# EasyEDA Pro project G-CU ver 2.3.C.eprj, board PCB1
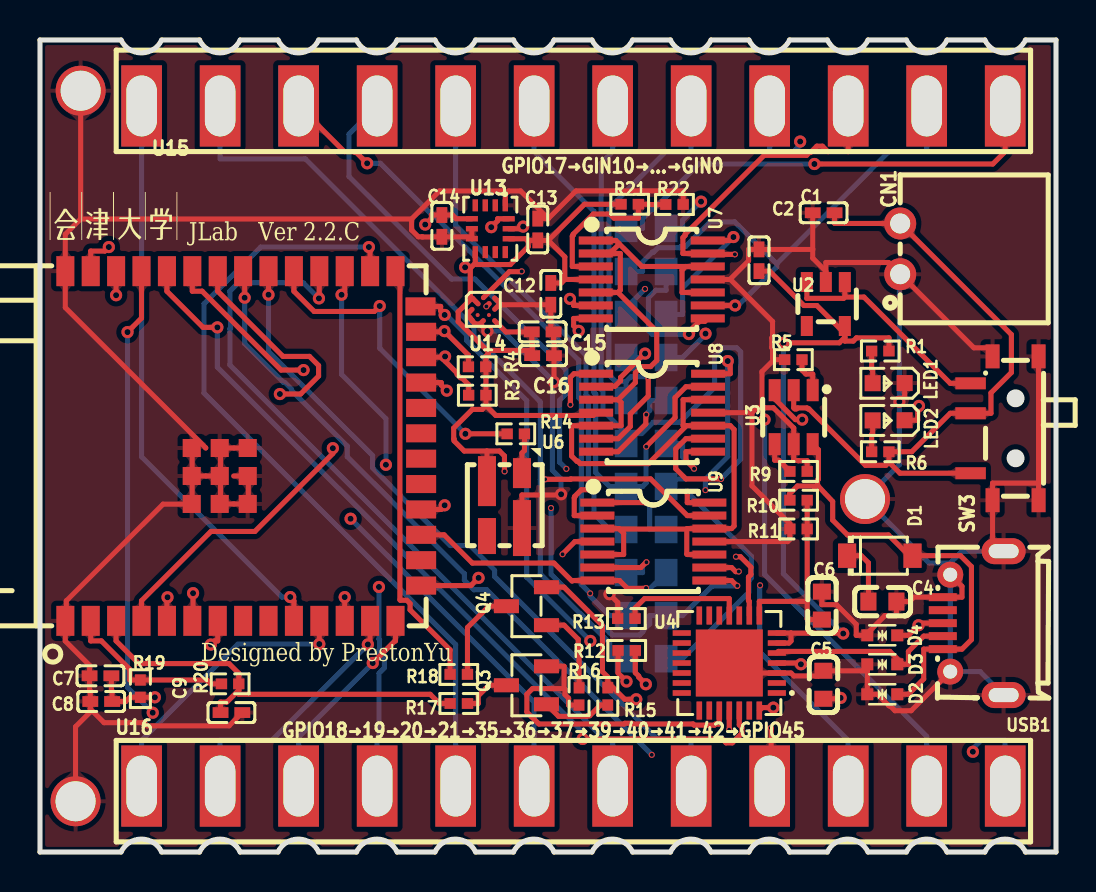
[diagram p2: board, top side]
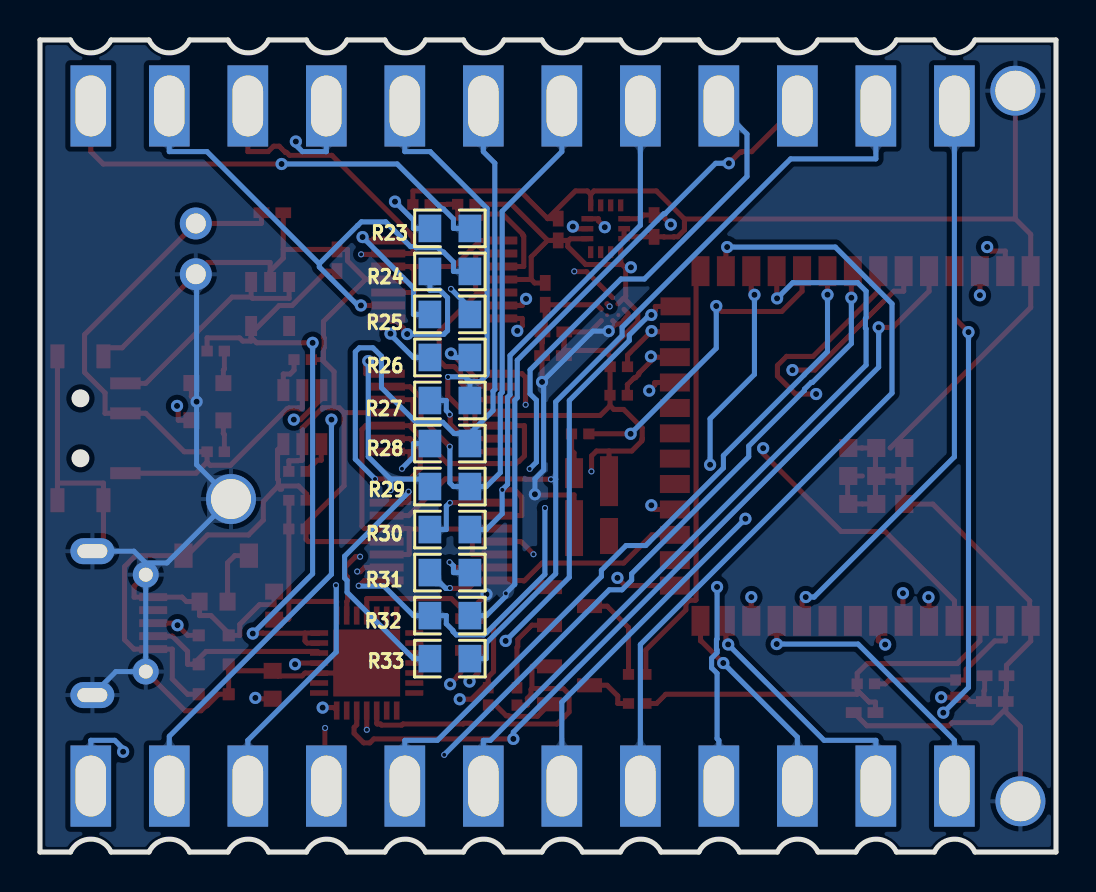
[diagram p3: board, bottom side, seen from below]

Outline 50.8 x 40.64 mm; copper layers: Top Layer, 信号层1, 信号层2, Bottom Layer. Coordinates in mm from the lower left corner of the outline.
Outline path: 0,40.64 0,0 4.05,0 arc(5.07,0.65) 6.08,0 7.98,0 arc(8.99,0.65) 10.01,0 11.9,0 arc(12.92,0.65) 13.93,0 15.83,0 arc(16.84,0.65) 17.86,0 19.75,0 arc(20.77,0.65) 21.78,0 23.67,0 arc(24.69,0.65) 25.71,0 27.6,0 arc(28.61,0.65) 29.63,0 31.52,0 arc(32.54,0.65) 33.55,0 35.45,0 arc(36.46,0.65) 37.48,0 39.37,0 arc(40.39,0.65) 41.4,0 43.32,0 arc(44.34,0.65) 45.35,0 47.24,0 arc(48.26,0.65) 49.28,0 50.8,0 50.8,40.64 49.28,40.64 arc(48.26,39.99) 47.25,40.64 45.35,40.64 arc(44.34,39.99) 43.32,40.64 41.4,40.64 arc(40.39,39.99) 39.37,40.64 37.48,40.64 arc(36.46,39.99) 35.45,40.64 33.55,40.64 arc(32.54,39.99) 31.52,40.64 29.63,40.64 arc(28.61,39.99) 27.6,40.64 25.71,40.64 arc(24.69,39.99) 23.67,40.64 21.78,40.64 arc(20.77,39.99) 19.75,40.64 17.86,40.64 arc(16.84,39.99) 15.83,40.64 13.93,40.64 arc(12.92,39.99) 11.9,40.64 10.01,40.64 arc(8.99,39.99) 7.98,40.64 6.08,40.64 arc(5.07,39.99) 4.05,40.64 0,40.64
Stack: Top Layer 0.035mm 外层铜厚1oz / Dielectric1 0.2104mm 7628 RC49% 8.6mil / 信号层1 0.035mm / Dielectric2 1.065mm 1.1mm H/HOZ Copper / 信号层2 0.035mm / Dielectric3 0.2104mm 7628 RC49% 8.6mil / Bottom Layer 0.035mm 外层铜厚1oz

## Design rules (mm)
template: JLCPCB Capability(Multiple Layers Board)
spacing copperThickness1oz (default): track to track 0.102, other pairs 0.152 to 0.3
spacing copperThickness2oz: track to track 0.203, other pairs 0.152 to 0.3
spacing copperThicknessInner0.5oz: track to track 0.089, other pairs 0.152 to 0.3
track width copperThickness1oz (default): min 0.102, default 0.254, max 2.54
track width copperThickness2oz: min 0.203, default 0.254, max 2.54
track width copperThickness0.5oz: min 0.089, default 0.254, max 2.54
differential pair differentialPair (default): width min 0.127, default 0.254, max 2.54; gap min 0.152, default 0.152
via viaSize (default): diameter min 0.3, default 0.61, max 10; hole min 0.2, default 0.305, max 6.3

## Placement (name value [footprint] x y rotation side)
C1  1uF  [c0402]  39.18 31.99 0 top
C2  1uF  [C0402]  35.95 29.61 270 top
C4  10uF  [C0603]  42.12 12.53 180 top
C5  10uF  [C0603]  39.17 8.37 270 top
C6  1uF  [C0603]  39.1 12.33 270 top
C7  10uF  [C0402]  3.02 8.82 0 top
C8  100pF  [C0402]  3.06 7.53 0 top
C9  1uF  [C0402]  9.57 6.98 180 top
C12  100pF  [C0402]  25.54 27.93 270 top
C13  100nF  [C0402]  24.89 31.15 270 top
C14  100nF  [C0402]  20.09 31.33 90 top
C15  100nF  [C0402]  25.13 26.03 180 top
C16  100nF  [C0402]  25.15 24.84 180 top
CN1  XH-2AW  [CONN-TH_XH-2AW_C2908611]  43.01 30.19 90 top
D1  1N5819HW-7-F  [SOD-123_L2.7-W1.6-LS3.7-RD]  41.99 14.83 0 top
D2  LESD5D5.0CT1G  [SOD-523_L1.2-W0.8-LS1.6-BI]  42.12 7.9 0 top
D3  LESD5D5.0CT1G  [SOD-523_L1.2-W0.8-LS1.6-BI]  42.12 9.39 0 top
D4  LESD5D5.0CT1G  [SOD-523_L1.2-W0.8-LS1.6-BI]  42.12 10.85 0 top
LED1  NCD0603R1  [LED0603-RD_RED]  42.43 23.47 180 top
LED2  NCD0603G1  [LED0603-RD]  42.43 21.6 180 top
NOREF  -  [Pad_e86]  2.03 38.1 0 top
NOREF#2  -  [Pad_e97]  41.25 17.66 0 top
NOREF#3  -  [Pad_e33]  1.78 2.54 0 top
Q3  L8050QLT1G  [SOT-23-3_L2.9-W1.3-P1.90-LS2.4-BR]  24.32 8.34 0 top
Q4  L8050QLT1G  [SOT-23-3_L2.9-W1.3-P1.90-LS2.4-BR]  24.32 12.3 0 top
R1  5.1kΩ  [R0402]  42.02 25.07 180 top
R3  4.7kΩ  [R0402]  21.87 22.86 0 top
R4  4.7kΩ  [R0402]  21.86 24.28 0 top
R5  10kΩ  [R0402]  37.67 24.64 0 top
R6  5.1kΩ  [R0402]  42.02 20.03 0 top
R9  680Ω  [R0402]  37.93 19.05 180 top
R10  22.1kΩ  [R0402]  37.93 17.61 180 top
R11  47.5kΩ  [R0402]  37.93 16.17 0 top
R12  1kΩ  [R0402]  29.33 10.09 180 top
R13  10kΩ  [R0402]  29.32 11.68 0 top
R14  0Ω  [R0402]  23.79 20.93 180 top
R15  10kΩ  [R0402]  28.39 7.79 270 top
R16  10kΩ  [R0402]  26.95 7.78 90 top
R17  0Ω  [R0402]  20.94 7.43 180 top
R18  0Ω  [R0402]  20.94 8.89 180 top
R19  0Ω  [R0402]  5.02 8.18 90 top
R20  10kΩ  [R0402]  9.51 8.42 180 top
R21  1.8kΩ  [R0402]  29.49 32.42 180 top
R22  200Ω  [R0402]  31.72 32.41 180 top
R23  5kΩ  [R0805]  30.31 31.21 0 bottom
R24  5kΩ  [R0805]  30.31 29.06 0 bottom
R25  5kΩ  [R0805]  30.31 26.9 0 bottom
R26  5kΩ  [R0805]  30.31 24.75 0 bottom
R27  5kΩ  [R0805]  30.31 22.6 0 bottom
R28  5kΩ  [R0805]  30.31 20.44 0 bottom
R29  5kΩ  [R0805]  30.31 18.29 0 bottom
R30  5kΩ  [R0805]  30.31 16.14 0 bottom
R31  5kΩ  [R0805]  30.31 13.98 0 bottom
R32  5kΩ  [R0805]  30.31 11.83 0 bottom
R33  5kΩ  [R0805]  30.31 9.68 0 bottom
SW3  MSK12C02  [SW-TH_MSK12C02]  48.23 21.21 90 top
U1  ESP32-S3-WROOM-1-N4  [WIRELM-SMD_ESP32-S3-WROOM-1]  10.16 20.32 90 top
U2  TLV75733PDBVR  [SOT-23-5_L2.9-W1.6-P0.95-LS2.8-BL]  39.29 27.43 180 top
U3  BQ21040DBVR  [SOT-23-6_L2.9-W1.6-P0.95-LS2.8-BR]  37.69 21.76 90 top
U4  CP2102N-A02-GQFN28  [QFN-28_L5.0-W5.0-P0.50-TL-EP3.3]  34.47 9.46 180 top
U6  SK6812mini  [LED-SMD_4P-L3.7-W3.5-P1.75-BR-SK6812MINI]  23.22 17.39 90 top
U7  OPA4314AIPWR  [TSSOP-14_L5.0-W4.4-P0.65-LS6.4-BL]  30.59 28.65 270 top
U8  OPA4314AIPWR  [TSSOP-14_L5.0-W4.4-P0.65-LS6.4-BL]  30.61 21.99 270 top
U9  OPA4314AIPWR  [TSSOP-14_L5.0-W4.4-P0.65-LS6.4-BL]  30.67 15.54 270 top
U13  BMI270  [LGA-14_L3.0-W2.5-P0.50-BR]  22.52 31.19 90 top
U14  BMM150  [WLCSP-12_L1.6-W1.6_BMM150]  22.17 27.16 90 top
U15  -  [GCU-CON ver 1.1.C]  49.53 35.05 180 top
U16  -  [GCU-CON ver 1.1.C]  3.81 5.59 0 top
USB1  MicroXNJ  [MICRO-USB-SMD_MICROXNJ]  46.66 11.45 90 top

## Footprints (pads in the part's own frame, mm; a bottom-side part is the same pattern mirrored in y, then rotated)
C0402
  rect 0.79x0.54 smd: 1(-0.545,0) 2(0.545,0)
c0402
  rect 0.79x0.54 smd: 1(-0.545,0) 2(0.545,0)
C0603
  rect 0.8x0.9 smd: 1(-0.7,0) 2(0.7,0)
CONN-TH_XH-2AW_C2908611
  round 1.6 hole 1: 1(-1.27,0) 2(1.27,0)
GCU-CON ver 1.1.C
  rect 2.032x4.064 hole 1.524x3.048: 1(1.27,-2.286) 2(5.196,-2.286) 3(9.121,-2.286) 4(13.046,-2.286) 5(16.972,-2.286) 6(20.898,-2.286) 7(24.823,-2.286) 8(28.748,-2.286) 9(32.673,-2.286) 10(36.599,-2.286) 11(40.525,-2.286) 12(44.45,-2.286)
LED0603-RD
  rect 0.8x0.8 smd: 1(-0.799,-0.004) 2(0.799,0.004)
LED0603-RD_RED
  rect 0.8x0.8 smd: 1(-0.799,-0.004) 2(0.799,0.004)
LED-SMD_4P-L3.7-W3.5-P1.75-BR-SK6812MINI
  rect 1.5x0.9 smd: 1(1.575,-0.875)
  rect 2.5x0.9 smd: 2(1.175,0.875)
  rect 1.8x0.9 smd: 3(-1.575,0.875)
  rect 2.8x0.9 smd: 4(-1.175,-0.875)
LGA-14_L3.0-W2.5-P0.50-BR
  rect 0.6x0.27 smd: 1(1.17,-0.75) 2(1.17,-0.25) 3(1.17,0.25) 4(1.17,0.75) 8(-1.17,0.75) 9(-1.17,0.25) 10(-1.17,-0.25) 11(-1.17,-0.75)
  rect 0.27x0.6 smd: 5(0.5,0.92) 6(0,0.92) 7(-0.5,0.92) 12(-0.5,-0.92) 13(0,-0.92) 14(0.5,-0.92)
MICRO-USB-SMD_MICROXNJ
  rect 0.4x1.4 smd: 1(-1.3,1.522) 2(-0.65,1.522) 3(0,1.522) 4(0.65,1.522) 5(1.3,1.522)
  round 1.3 hole 0.7: 6(2.425,1.149) 9(-2.425,1.149)
  oval 1.3x2.2 hole 0.7x1.5: 7(3.6,-1.522) 8(-3.6,-1.522)
Pad_e33
  round 2.5 hole 2: 42(0,0)
Pad_e86
  round 2.5 hole 2: 42(0,0)
Pad_e97
  round 2.5 hole 2: 42(0,0)
QFN-28_L5.0-W5.0-P0.50-TL-EP3.3
  rect 0.905x0.28 smd: 1(-2.377,1.5) 2(-2.377,1) 3(-2.377,0.5) 4(-2.377,0) 5(-2.377,-0.5) 6(-2.377,-1) 7(-2.377,-1.5) 15(2.377,-1.5) 16(2.377,-1) 17(2.377,-0.5) 18(2.377,0) 19(2.377,0.5) 20(2.377,1) 21(2.377,1.5)
  rect 0.28x0.905 smd: 8(-1.5,-2.377) 9(-1,-2.377) 10(-0.5,-2.377) 11(0,-2.377) 12(0.5,-2.377) 13(1,-2.377) 14(1.5,-2.377) 22(1.5,2.377) 23(1,2.377) 24(0.5,2.377) 25(0,2.377) 26(-0.5,2.377) 27(-1,2.377) 28(-1.5,2.377)
  rect 3.35x3.35 smd: 29(0,0)
R0402
  rect 0.566x0.54 smd: 1(-0.433,0) 2(0.433,0)
R0805
  rect 1.133x1.377 smd: 1(-1,0) 2(1,0)
SOD-123_L2.7-W1.6-LS3.7-RD
  rect 0.91x1.22 smd: 1(-1.635,0) 2(1.635,0)
SOD-523_L1.2-W0.8-LS1.6-BI
  rect 0.6x0.6 smd: 1(-0.75,0) 2(0.75,0)
SOT-23-3_L2.9-W1.3-P1.90-LS2.4-BR
  rect 1.25x0.7 smd: 1(1,-0.95) 2(1,0.95) 3(-1,0)
SOT-23-5_L2.9-W1.6-P0.95-LS2.8-BL
  rect 0.6x1 smd: 1(-0.95,-1.1) 2(0,-1.1) 3(0.95,-1.1) 4(0.95,1.1) 5(-0.95,1.1)
SOT-23-6_L2.9-W1.6-P0.95-LS2.8-BR
  rect 1.1x0.6 smd: 1(1.35,-0.95) 2(1.35,0) 3(1.35,0.95) 4(-1.35,0.95) 5(-1.35,0) 6(-1.35,-0.95)
SW-TH_MSK12C02
  rect 0.6x1.524 smd: 1(-2.25,1.7) 2(0.75,1.7) 3(2.25,1.7)
  rect 1.2x0.7 smd: 4(-3.6,0.6) 4(-3.6,-1.7) 4(3.6,0.6) 4(3.6,-1.7)
TSSOP-14_L5.0-W4.4-P0.65-LS6.4-BL
  rect 0.4x1.7 smd: 1(-1.95,-2.8) 2(-1.3,-2.8) 3(-0.65,-2.8) 4(0,-2.8) 5(0.65,-2.8) 6(1.3,-2.8) 7(1.95,-2.8) 8(1.95,2.8) 9(1.3,2.8) 10(0.65,2.8) 11(0,2.8) 12(-0.65,2.8) 13(-1.3,2.8) 14(-1.95,2.8)
WIRELM-SMD_ESP32-S3-WROOM-1
  rect 1.5x0.9 smd: 1(-8.75,8.895) 2(-8.75,7.625) 3(-8.75,6.355) 4(-8.75,5.085) 5(-8.75,3.815) 6(-8.75,2.545) 7(-8.75,1.275) 8(-8.75,0.005) 9(-8.75,-1.265) 10(-8.75,-2.535) 11(-8.75,-3.805) 12(-8.75,-5.075) 13(-8.75,-6.345) 14(-8.75,-7.615) 27(8.75,-7.615) 28(8.75,-6.345) 29(8.75,-5.075) 30(8.75,-3.805) 31(8.75,-2.535) 32(8.75,-1.265) 33(8.75,0.005) 34(8.75,1.275) 35(8.75,2.545) 36(8.75,3.815) 37(8.75,5.085) 38(8.75,6.355) 39(8.75,7.625) 40(8.75,8.895)
  rect 0.9x1.5 smd: 15(-6.985,-8.895) 16(-5.715,-8.895) 17(-4.445,-8.895) 18(-3.175,-8.895) 19(-1.905,-8.895) 20(-0.635,-8.895) 21(0.635,-8.895) 22(1.905,-8.895) 23(3.175,-8.895) 24(4.445,-8.895) 25(5.715,-8.895) 26(6.985,-8.865)
  rect 0.9x0.9 smd: 41(-2.9,2.575) 41(-2.9,1.175) 41(-2.9,-0.225) 41(-1.5,2.575) 41(-1.5,1.175) 41(-1.5,-0.225) 41(-0.1,2.575) 41(-0.1,1.175) 41(-0.1,-0.225)
WLCSP-12_L1.6-W1.6_BMM150
  round 0.2 smd: A1(0.566,0.566) A3(0.566,0) A5(0.566,-0.566) B2(0.283,0.283) B4(0.283,-0.283) C1(0,0.566) C5(0,-0.566) D2(-0.283,0.283) D4(-0.283,-0.283) E1(-0.566,0.566) E3(-0.566,0) E5(-0.566,-0.566)

## Nets
As in the schematic, except:
GND: C1.1 C2.1 C4.1 C5.1 C6.1 C7.1 C8.1 C9.1 C12.2 C13.1 C14.1 C15.1 C16.1 CN1.1 D2.1 D3.1 D4.1 LED1.1 NOREF.42 NOREF#2.42 NOREF#3.42 R5.1 R9.1 R11.1 R13.1 R22.1 SW3.4 U1.1 U1.40 U1.41 U2.2 U3.5 U4.3 U4.29 U6.4 U7.11 U8.11 U9.11 U13.1 U13.6 U13.7 U14.A5 U14.C1 U14.C5 U14.E1 U14.E3 USB1.5 USB1.6 USB1.7 USB1.8 USB1.9

Pads without a net: U1 8 9 16 20 21 22; U2 4; U4 1 2 10 12 13 14 15 16 17 18 19 20 21 22 23 27; U6 3; U13 2 3 4 9 10 11; U14 D2 D4; USB1 4

## Via types
v1: diameter 0.61, hole 0.305, Top Layer to Bottom Layer, 69 vias
v2: diameter 0.305, hole 0.203, Top Layer to Bottom Layer, 29 vias

## Routing (per net, layer and track width the routed paths; a pad name or vN(x,y) marks a point on that pad's centre or on a via; arc(x,y) is an arc through that point)
GND: length 278.7
  Top Layer w0.254: 34.5,28.65 35.43,29.59 35.43,30.16 C2.1 38.64,30.16 ; 34.5,28.65 34.52,28.65 36.63,26.55 36.63,25.77 36.59,25.72 36.59,25.24 36.63,25.2 36.63,24.71 36.7,24.64 ; 34.5,28.65 U7.11 ; v1(42.97,22.54) 43.23,22.8 LED1.1 ; C9.1 9.46,6.32 5.36,6.32 5.2,6.47 3.2,6.47 2.51,7.16 ; 38.64,30.16 38.64,31.99 ; 38.64,30.16 38.64,29.72 39.29,29.06 ; 23.07,27.39 25.54,27.39 25.54,25.97 25.68,25.84 ; 23.07,27.39 U14.A5 ; 23.07,27.39 22.96,27.39 ; 36.1,22.23 36.1,24.04 36.7,24.64 ; 36.1,22.23 36.67,22.23 37.68,21.22 37.69,21.22 U3.5 37.69,19.62 37.71,19.6 37.89,19.6 37.91,19.58 38.36,19.58 38.36,19.05 ; 36.1,22.23 35.84,22.23 35.6,21.99 ; U1.1 1.27,10.56 2.48,9.34 C7.1 2.48,8.09 2.51,8.06 C8.1 2.51,7.16 ; v1(25.7,23.52) C16.1 25.7,25.48 25.68,25.51 25.68,25.84 ; NOREF.42 2.03,31.68 ; 2.03,31.68 1.27,30.91 U1.40 1.27,27.25 8.29,20.23 8.29,20.22 ; 2.03,31.68 18.58,31.68 ; 23.27,32.92 23.43,33.08 24.03,33.08 25.41,31.7 ; 23.27,32.92 23.27,32.36 ; 23.27,32.92 23.1,33.08 19.98,33.08 18.58,31.68 ; 7.57,17.41 7.56,17.4 ; 7.57,17.41 7.61,17.41 ; 7.57,17.41 6.15,17.41 1.32,12.57 1.32,11.63 ; 33.47,15.54 37.39,15.54 37.5,15.65 37.5,16.43 35.6,18.33 35.6,21.99 ; 41.37,9.07 41.37,7.9 41.87,7.9 42.45,7.32 42.5,7.32 42.75,7.07 43.56,7.07 USB1.9 ; 41.37,9.07 39.17,9.07 38.91,8.81 37.7,8.81 37.55,8.96 34.97,8.96 U4.29 ; 41.37,9.07 41.37,9.39 ; 21.59,30.79 19.61,30.79 19.6,30.78 19.12,30.78 19.11,30.79 18.92,30.79 18.58,31.13 18.58,31.68 ; 21.59,30.79 U13.6 ; 21.59,30.79 U13.7 ; R5.1 36.7,24.64 ; 41.26,10.85 42.25,11.83 42.82,11.83 42.82,12.53 43.48,12.53 43.7,12.76 USB1.5 46.1,12.76 46.1,13.3 45.51,13.88 ; 41.26,10.85 40.81,10.85 40.81,11.39 39.83,12.38 39.1,12.38 C6.1 ; 41.26,10.85 41.37,10.85 ; 9.69,18.82 U1.41 ; 35.6,21.99 33.41,21.99 ; 47.63,24.81 47.63,25.23 46.69,25.23 43.01,28.92 42.43,29.5 39.29,29.5 39.29,29.06 ; 25.41,31.7 24.89,31.7 ; 25.41,31.7 26.8,33.09 32.16,33.09 R22.1 ; 25.68,25.84 C15.1 ; 22.74,27.17 22.96,27.39 ; 9.03,20.22 9.03,17.43 ; 9.03,20.22 9.03,20.23 ; 9.03,20.22 9.69,20.22 U1.41 ; 7.53,18.81 7.54,18.82 ; 7.61,18.82 8.29,18.82 ; 8.99,17.42 9.69,17.42 10.37,17.42 ; 48.18,15.05 47.63,15.61 SW3.4 47.63,18.46 49.93,18.46 ; 39.29,29.06 U2.2 ; 49.93,24.81 49.93,18.46 ; 49.93,18.46 SW3.4 ; 10.42,18.83 10.42,17.46 ; 1.78,2.54 1.78,6.27 2.51,7.01 2.51,7.16 ; 8.29,18.82 8.67,18.82 ; R13.1 28.89,12.49 v1(28.48,12.9) ; 22,26.43 22.17,26.59 ; 22,26.43 21.77,26.43 U14.E1 21.6,26.62 21.5,26.72 21.5,26.74 21.39,26.85 21.39,26.95 U14.C1 ; 22,26.43 22.36,26.07 v1(22.37,26.07) ; 7.61,18.89 7.61,20.22 ; 7.61,18.78 7.61,17.45 ; v1(26.06,17.9) 26.02,17.87 24.1,17.87 24.1,16.21
  信号层1 w0.254: v1(42.97,22.54) 41.49,21.06 35.87,21.06 33.71,23.21 30.08,23.21 29.77,23.52 v1(25.7,23.52)
  信号层2 w0.254: v1(22.37,26.07) 22.37,25.9 20.54,24.08 14.95,24.08 10.39,19.52 ; v1(28.48,12.9) 28.48,15.48 v1(26.06,17.9)
  Bottom Layer w0.254: 45.51,14.47 46.1,15.05 48.18,15.05 ; 45.51,14.47 USB1.9 47.01,9.03 48.18,7.85 ; 45.51,14.47 44.45,14.47 41.25,17.66 42.97,19.38 v1(42.97,22.54) 42.97,28.88 43.01,28.92 ; v1(22.37,26.07) 23.15,26.07 v1(25.7,23.52) 25.62,23.44 25.62,19.11 26.06,18.67 v1(26.06,17.9)
VBAT: length 33.7
  Top Layer w0.254: 42.45,19.51 42.29,19.35 41.27,19.35 38.45,22.18 38.4,22.18 38.35,22.22 37.87,22.22 37.82,22.18 37.74,22.18 37.69,22.23 37.69,23.11 ; 42.45,19.51 R6.2 43.59,20.03 45.51,21.96 47.55,21.96 47.55,22.98 48.57,24 48.57,25.9 43.01,31.46 39.74,31.46 39.73,31.47 39.73,31.99 ; 42.45,19.51 43,18.96 46.53,18.96
VBUS: length 23.4
  Top Layer w0.254: 37.47,17.6 37.47,17.91 37.88,18.32 38.72,18.32 ; 38.64,20.41 38.92,20.13 38.92,18.66 38.88,18.62 38.88,18.32 38.9,18.32 ; 38.94,18.28 38.91,18.31 39.63,17.54 39.63,16.61 40.38,15.87 42.42,15.87 43.58,14.71 ; D2.2 43.42,7.9 44.19,8.66 44.19,10.15 USB1.1 46.1,10.15 46.57,10.63 46.57,14.28 46.03,14.83 43.63,14.83 ; 38.72,18.16 38.81,18.16
VCC_3V3: length 148
  Top Layer w0.254: 21.9,27.43 21.65,27.69 21.6,27.69 ; 21.77,29.47 21.83,29.4 23.52,29.4 24.41,30.3 24.41,30.61 ; 21.77,29.47 U13.8 ; 21.77,29.47 21.52,29.22 ; v1(19.26,31.4) 19.57,31.71 19.57,31.88 C14.2 20.62,31.88 20.81,31.69 U13.5 ; v1(29.33,8.53) 28.9,8.96 28.9,10.09 ; 25.54,28.48 26.07,28.48 26.24,28.65 ; 40.24,25.95 38.84,27.35 38.19,27.35 36.48,29.07 C2.2 ; 40.24,25.95 40.24,25.76 ; 40.24,25.95 40.24,26.33 ; 24.41,30.61 25.41,30.61 ; 24.41,30.61 24.37,30.61 24.28,30.69 23.44,30.69 ; 40.24,25.76 39.97,25.48 v1(37.17,25.48) ; 40.24,25.76 40.24,25.57 40.66,25.57 40.82,25.73 42.45,25.73 R1.1 ; 22.3,22.34 R3.2 22.3,24.53 22.29,24.54 ; 22.3,22.34 22.11,22.15 21.62,22.15 20.69,21.22 20.69,20.69 20.71,20.67 20.71,20.57 21.21,20.07 22.35,20.07 ; 22.3,22.34 22.79,21.85 27.67,21.85 27.81,21.99 ; 25.41,30.61 27.22,32.42 R21.2 ; 25.41,30.61 26.24,29.78 26.24,28.65 ; 37.55,10.96 37.56,10.95 39.66,10.95 39.67,10.96 40.14,10.96 v1(40.16,10.93) ; 37.55,10.96 37.55,10.56 37.45,10.46 U4.6 ; 37.55,10.96 U4.7 ; 26.12,14.9 26.75,15.54 27.87,15.54 ; v1(5.74,7.74) R19.1 4.5,7.74 4.29,7.53 C8.2 3.6,8.06 3.57,8.09 C7.2 ; v1(21.26,29.26) 21.47,29.26 21.52,29.22 ; 22.29,24.28 22.29,24.54 ; 22.29,24.54 22.29,24.81 22.42,24.94 22.42,25.03 ; 22.35,20.07 22.98,20.07 23.22,19.82 23.22,19.06 ; 22.35,20.07 22.35,18.56 ; 26.24,28.65 27.79,28.65 ; C16.2 24.61,25.11 ; 24.61,25.11 24.61,25.37 24.59,25.39 C15.2 23.29,26.03 U14.E5 ; 24.61,25.11 22.49,25.11 22.42,25.03 ; 21.52,29.22 21.52,27.81 U14.A1 20.91,27.03 20.91,26.54 22.42,25.03 ; v1(40.03,7.71) 39.99,7.67 C5.2
  信号层1 w0.254: 27.81,11.23 27.8,11.24 ; 27.8,11.24 39.86,11.24 v1(40.16,10.93) ; 27.8,11.24 27.77,11.24 ; 26.71,10.5 26.71,11.07 27.23,11.59 27.48,11.59 27.76,11.31 27.76,11.24 ; v1(5.74,7.74) 28.54,7.74 v1(29.33,8.53) 28.67,8.53 26.72,10.48 ; v1(21.26,29.26) 21.26,29.41 v1(19.26,31.4)
  信号层2 w0.254: v1(40.03,7.71) 40.16,7.84 v1(40.16,10.93) ; v1(29.33,8.53) 29.33,9.68 27.72,11.28 27.66,11.28 26.12,12.82 26.12,14.9 23.22,17.8 23.22,19.06
  Bottom Layer w0.254: v1(40.16,10.93) 37.17,13.93 v1(37.17,25.48)
  vias: v2(23.23,19.05) v2(26.13,14.9)
VCC_5V: length 3.2
  Top Layer w0.254: 40.36,14.83 41.07,14.83 41.42,14.47 41.42,12.53
CHIP_PU: length 21.3
  Top Layer w0.254: 9.94,8.1 9.34,7.5 9.03,7.5 C9.2 ; 9.94,8.1 9.94,8.94 9.45,9.43 4.94,9.43 3.81,10.57 U1.3 ; 9.94,8.1 9.94,7.89 19.51,7.89 19.97,7.43 R17.2
DTR: length 16.4
  Top Layer w0.254: v1(29.81,7.65) 29.23,7.65 28.39,8.49 ; 28.39,8.49 R15.1 ; 28.39,8.49 28.39,8.76 28.12,9.03 28.12,11.34 26.21,13.25 25.32,13.25 ; v1(36.67,7.23) 36.11,7.23 35.97,7.08
  信号层1 w0.254: v1(36.67,7.23) 36.25,7.65 v1(29.81,7.65)
ESP_3V3: length 8.7
  Top Layer w0.254: 9.07,8.42 8.54,8.42 8.34,8.61 R19.2 4.5,8.61 4.5,9.14 3.07,10.57 2.54,10.57 2.54,11.57
GIN0: length 39.6
  Top Layer w0.254: v1(26.5,27.68) 26.68,27.5 26.68,27.35 27.79,27.35 ; U15.1 48.26,35.05 47.64,34.43 v1(38.72,34.43)
  信号层1 w0.254: v1(38.72,34.43) 33.25,34.43 v1(26.5,27.68)
  Bottom Layer w0.254: 29.3,31.21 30.13,31.21 30.13,31.68 30.62,32.18 30.68,32.18 32.94,34.43 v1(38.72,34.43)
GIN1: length 26.2
  Top Layer w0.254: U7.9 v1(34.75,27.35)
  Bottom Layer w0.254: 36.84,29.44 42.45,35.05 44.34,35.05 U15.2 ; 36.84,29.44 36.84,29.28 34.91,27.35 v1(34.75,27.35) ; 36.84,29.44 36.84,29.44 34.92,31.36 34.91,31.36 34.73,31.54 33.51,31.54 32.27,30.3 32.04,30.3 31.99,30.24 30.9,30.24 30.68,30.02 30.62,30.02 30.13,29.53 30.13,29.06 29.3,29.06
GIN2: length 22.5
  Top Layer w0.254: 33.78,29.91 33.78,29.91 34.76,29.91 ; U15.3 40.41,35.05 39.4,35.05 39.12,35.32 38.84,35.32 38.53,35.02 38.48,35.02 38.33,34.87 36.21,34.87 32.26,30.92 32.26,30.86 32.15,30.75 32.15,29.95 U7.13
  信号层1 w0.254: 34.73,29.91 31.98,29.91 v2(30.25,28.18)
  Bottom Layer w0.254: 29.36,26.88 29.36,27.28 v2(30.25,28.18)
  vias: v2(34.75,29.91)
GIN3: length 25.1
  Top Layer w0.254: 29.03,23.59 28.75,23.31 28.35,23.31 ; 29.03,23.59 29.03,23.59 ; 29.03,23.59 29.03,23.75 30.22,24.94 v1(30.25,24.94)
  信号层1 w0.254: v1(30.25,24.94) 33.11,24.94 34.94,26.77 35,26.77 35.34,27.11 35.34,27.17 39.58,31.41 39.58,34.73 39.03,35.27 38.29,35.27 v1(38.01,35.56)
  Bottom Layer w0.254: U15.4 36.48,35.05 37.68,35.05 38.01,35.38 v1(38.01,35.56) ; R26.1 30.13,24.75 30.25,24.88 v1(30.25,24.94)
GIN4: length 23.9
  Top Layer w0.254: 27.81,20.69 28.91,20.69 29.52,21.29 29.52,21.92 30.41,22.82 30.41,23.8
  Bottom Layer w0.254: 29.3,23.54 R27.1 ; 29.3,23.54 28.79,23.54 28.46,23.87 28.46,23.98 28.44,24 28.44,32.2 31.29,35.05 32.56,35.05 32.56,37.34 ; 29.3,23.54 29.54,23.78 30.4,23.78 30.41,23.8
  vias: v2(30.4,23.77)
GIN5: length 38.2
  Top Layer w0.254: 33.41,20.69 32.3,20.69 31.79,20.18 31.79,19.18 32.3,18.67 34.05,18.67
  Bottom Layer w0.254: 29.3,20.94 28.15,22.1 28.15,23.06 28.06,23.15 28.06,34.47 28.63,35.05 U15.6 ; 29.3,20.94 R28.1 ; 29.3,20.94 30.09,20.94 30.66,21.51 32,21.51 33.73,23.24 33.73,24.81 34.15,25.23 34.83,25.23 35.03,25.03 35.03,19.66 34.05,18.67
  vias: v2(34.05,18.67)
GIN6: length 29.3
  Top Layer w0.254: 30.3,20.29 31.75,21.74 31.75,22.74 32.3,23.29 33.41,23.29
  Bottom Layer w0.254: 30.3,20.29 30.3,18.47 30.13,18.29 28.48,18.29 27.78,18.99 27.78,22.91 27.69,23.01 27.69,32.07 24.71,35.05 U15.7
  vias: v2(30.31,20.29)
GIN7: length 28.4
  Top Layer w0.254: U9.2 26.71,16.84 26.71,17.73 26.74,17.76 26.74,17.8 27.07,18.13 27.69,18.13
  Bottom Layer w0.254: U15.8 20.78,31.36 27.3,24.85 27.3,22.89 27.42,22.76 27.42,18.4 27.69,18.13 27.69,16.93 28.48,16.14 29.3,16.14
  vias: v2(27.68,18.12)
GIN8: length 34.5
  Top Layer w0.254: 30.3,14.5 30.05,14.24 27.87,14.24
  信号层2 w0.254: 26.3,19.19 26.3,18.5 30.3,14.5
  Bottom Layer w0.254: 26.3,19.19 25.98,19.51 25.98,22.61 26.3,22.93 26.3,24.13 21.75,28.68 20.58,28.68 15.45,33.81 15.45,35.93 U15.9 ; 29.3,13.98 30.13,13.98 30.13,14.32 30.3,14.5
  vias: v2(26.32,19.18) v2(30.32,14.5)
GIN9: length 42.9
  Top Layer w0.254: 33.47,14.24 34.58,14.24 34.79,14.03 34.93,14.03 ; 12.93,37.34 15.22,35.05 15.7,35.05 15.73,35.03 15.8,35.03 v1(16.36,34.47)
  信号层1 w0.254: 27.51,12.95 28.51,13.95 34.85,13.95 34.93,14.03
  Bottom Layer w0.254: v1(16.36,34.47) 17.02,34.47 19.54,31.95 19.6,31.95 26.94,24.61 26.94,22.73 27.06,22.61 27.06,13.4 27.51,12.95 27.51,12.8 28.48,11.83 R32.1
  vias: v2(27.51,12.94) v2(34.94,14.04)
GIN10: length 48.3
  Top Layer w0.254: 25.27,18.65 26.52,18.65 26.54,18.67 30.53,18.67 32.36,16.84 U9.13
  Bottom Layer w0.254: 25.02,18.65 25.27,18.65 ; 25.02,18.65 25.02,22.53 21.7,25.84 21.7,26.26 13.27,34.69 9.01,34.69 U15.11 ; 25.02,18.65 25.02,13.93 28.48,10.46 28.48,9.68 R33.1
  vias: v2(25.25,18.65)
GPIO0: length 21.5
  Top Layer w0.254: 20.51,8.89 20.51,10.12 18.5,12.12 18.5,12.44 18.34,12.6 18.02,12.6 18,12.62 18,28.85 17.78,29.07
GPIO1: length 40.5
  Top Layer w0.254: v1(3.44,30.28) 3.24,30.08 2.54,30.08 2.54,29.07 ; v1(26.94,26.08) 26.68,26.34 26.68,26.7 27.79,26.7
  信号层1 w0.254: v1(33.05,32.55) 27.09,26.58 26.94,26.58 ; 26.94,26.58 24.46,26.58 22.36,28.68 5.04,28.68 v1(3.44,30.28) ; 26.94,26.58 v1(26.94,26.08)
  Bottom Layer w0.254: 31.31,31.21 32.13,31.21 32.13,31.63 v1(33.05,32.55)
GPIO2: length 38.2
  Top Layer w0.254: U7.8 33.25,26.56 32.97,26.56 32.63,26.22 32.63,25.95 32.61,25.92 v1(32.44,25.92) ; U1.38 v1(3.81,27.87)
  信号层1 w0.254: v1(32.44,25.92) 32.05,25.53 27.21,25.53 27.17,25.49 19.98,25.49 19.94,25.53 6.14,25.53 v1(3.81,27.87)
  Bottom Layer w0.254: v1(32.44,25.92) 32.43,25.91 30.61,25.91 30.42,26.1 30.42,27.74 30.8,28.11 31.31,28.11 31.31,29.06
GPIO3: length 32.8
  Top Layer w0.254: U7.14 34.5,30.6 34.67,30.78 v1(34.67,30.78) ; 19.06,13.33 21.54,13.33 v1(21.93,13.72)
  信号层2 w0.254: v1(21.93,13.72) 21.93,18.56 34.15,30.78 v1(34.67,30.78)
  Bottom Layer w0.254: v1(34.67,30.78) 32.13,28.23 32.13,26.9 R25.2
GPIO4: length 40.7
  Top Layer w0.254: 5.08,11.57 5.08,12.58 8.54,16.04 10.74,16.04 14.64,19.94 v1(14.64,20.21) ; 26.52,22.39 26.52,23.76 26.7,23.94 27.81,23.94
  信号层1 w0.254: 26.52,22.39 16.82,22.39 v1(14.64,20.21)
  信号层2 w0.254: 26.52,22.39 30.68,26.55 32,26.55 32.04,26.59 32.53,26.59 32.57,26.55 32.67,26.55 v1(33.28,25.94)
  Bottom Layer w0.254: R26.2 32.13,24.75 33.28,25.9 v1(33.28,25.94)
  vias: v2(26.52,22.38)
GPIO5: length 40.8
  Top Layer w0.254: 30.29,21.9 30.29,21.42 28.91,20.04 27.81,20.04 ; v1(6.38,12.75) 6.34,12.72 U1.5
  信号层1 w0.254: v1(6.38,12.75) 6.93,12.19 9.75,12.19 12.06,14.5 24.95,14.5 29.11,18.66 32.96,18.66 33.31,19.02 33.31,19.51 30.92,21.9 30.29,21.9
  Bottom Layer w0.254: 30.29,21.9 30.49,22.1 30.49,22.6 R27.2
  vias: v2(30.31,21.89)
GPIO6: length 34
  Top Layer w0.254: 33.41,20.04 32.3,20.04 32.3,19.6 32.69,19.21 ; 7.62,11.57 7.65,11.61 v1(7.65,12.95)
  信号层1 w0.254: 32.69,19.21 32.17,19.73 17.86,19.73 17.63,19.96 15.96,19.96 8.95,12.95 v1(7.65,12.95)
  Bottom Layer w0.254: 32.69,19.21 32.13,19.77 32.13,20.44 R28.2
  vias: v2(32.7,19.18)
GPIO7: length 40.2
  Top Layer w0.254: 33.41,23.94 34.51,23.94 34.51,24.44 v1(34.39,24.57) ; v1(8.54,10.38) 8.72,10.57 8.88,10.57 U1.7
  信号层1 w0.254: 33.27,18.1 30.2,15.04 28.58,15.04 24.78,11.24 9.4,11.24 v1(8.54,10.38)
  Bottom Layer w0.254: 33.27,18.67 31.68,18.67 31.31,18.29 ; 33.27,18.67 34.39,19.78 v1(34.39,24.57) ; 33.27,18.67 33.27,18.1
  vias: v2(33.27,18.11)
GPIO8: length 23
  Top Layer w0.254: v1(15.24,12.76) U1.12 ; U9.1 30.3,17.49
  信号层1 w0.254: 30.3,17.49 25.5,12.68 15.31,12.68 v1(15.24,12.76)
  Bottom Layer w0.254: 30.3,17.49 30.49,17.31 30.49,16.14 31.31,16.14
  vias: v2(30.31,17.48)
GPIO9: length 13.7
  Top Layer w0.254: 30.3,13.19 29.37,13.19 28.98,13.59 U9.7 26.61,13.59 ; 26.61,13.55 25.7,14.46 21.62,14.46 20.2,15.88 19.07,15.88
  Bottom Layer w0.254: 31.31,13.98 30.52,13.19 30.3,13.19
  vias: v2(30.3,13.21)
GPIO10: length 23.3
  Top Layer w0.254: 19.06,17.14 20.06,17.14 20.06,17.18 v1(20.23,17.35) ; U9.8 34.58,13.59 34.86,13.31
  信号层1 w0.254: 25.56,17.23 20.36,17.23 v1(20.23,17.35)
  Bottom Layer w0.254: 34.86,13.31 33.6,13.31 32.13,11.83 R32.2 30.49,11.83 30.49,11.42 30.15,11.08 30.15,11.03 29.99,10.86 28.62,10.86 28.53,10.96 28.49,10.96 25.56,13.9 25.56,17.23
  vias: v2(25.55,17.22) v2(34.87,13.32)
GPIO11: length 13.5
  Top Layer w0.254: 32.36,18.01 32.36,18.01 32.36,17.49 U9.14
  Bottom Layer w0.254: R33.2 32.13,9.68 35.45,13 35.45,13.59 35.57,13.71 35.57,14.8 32.36,18.01
  vias: v2(32.38,18.03)
GPIO17: length 29.2
  Top Layer w0.254: v1(12.51,12.76) 12.69,12.58 12.69,11.57
  Bottom Layer w0.254: U15.12 5.08,19.78 12.1,12.76 v1(12.51,12.76)
GPIO18: length 14.3
  Top Layer w0.254: v1(13.97,10.41) U1.11
  Bottom Layer w0.254: v1(13.97,10.41) 9.9,10.41 5.08,5.59 U16.1
GPIO19: length 12.9
  Top Layer w0.254: U1.13 16.5,10.5 v1(16.39,10.39)
  Bottom Layer w0.254: U16.2 9.01,5.59 11.59,5.59 v1(16.39,10.39)
GPIO20: length 10.3
  Top Layer w0.254: 17.78,11.57 17.78,10.57 17.74,10.57 v1(16.64,9.46)
  Bottom Layer w0.254: 12.93,3.3 12.93,5.75 v1(16.64,9.46)
GPIO21: length 23
  Top Layer w0.254: v1(20.34,23.09) 20.06,23.37 20.06,23.49 19.06,23.49
  信号层2 w0.254: v1(20.34,23.09) 18.47,21.22 18.47,14.78 v1(16.95,13.27)
  Bottom Layer w0.254: U16.4 16.86,5.59 16.95,5.68 16.95,8.94 17.22,9.22 17.22,9.7 16.95,9.97 16.95,10.12 16.98,10.15 16.98,10.63 16.95,10.66 v1(16.95,13.27)
GPIO35: length 40
  Top Layer w0.254: U1.28 16.5,30.08 16.44,30.14 v1(16.44,30.28)
  Bottom Layer w0.254: U16.5 20.78,10.38 8.2,22.97 8.2,27.44 11.04,30.28 v1(16.44,30.28)
GPIO36: length 31.3
  Top Layer w0.254: v1(15.08,27.89) 15.24,28.04 U1.29
  信号层1 w0.254: v1(17.3,19.38) 15.53,17.61 v1(15.53,16.68)
  Bottom Layer w0.254: v1(17.3,19.38) 17.3,21.68 15.08,23.9 v1(15.08,27.89) ; v1(15.53,16.68) 24.71,7.5 U16.6
GPIO37: length 39.3
  Top Layer w0.254: v1(13.95,27.71) 13.97,27.73 U1.30
  Bottom Layer w0.254: U16.7 28.63,5.59 28.28,5.59 9.49,24.37 9.49,26.19 9.53,26.22 9.53,26.71 9.49,26.74 9.49,28.07 9.92,28.49 13.16,28.49 v1(13.95,27.71)
GPIO38: length 16.1
  Top Layer w0.254: v1(16.99,27.33) 16.72,27.05 13.71,27.05 12.69,28.07 12.69,29.07 ; 23.36,20.93 v1(21.27,20.93)
  Bottom Layer w0.254: v1(16.99,27.33) 16.99,25.21 v1(21.27,20.93)
GPIO39: length 36.1
  Top Layer w0.254: v1(11.43,27.89) U1.32
  Bottom Layer w0.254: 32.56,3.3 32.56,5.59 30.93,5.59 22.73,13.79 22.73,14.1 21.49,15.34 20.51,15.34 16.63,19.22 16.63,19.84 12.59,23.88 12.59,23.88 11.43,25.05 v1(11.43,27.89)
GPIO40: length 40.7
  Top Layer w0.254: 36.56,6.19 36.56,5.05 36.58,5.03 ; v1(10.23,27.74) 10.23,28.99 10.16,29.07
  信号层1 w0.254: 30.61,4.86 31.4,5.65 35.96,5.65 36.52,6.21
  Bottom Layer w0.254: v1(10.23,27.74) 10.23,25.45 12.17,23.5 12.24,23.5 12.58,23.16 12.58,23.1 15.36,20.31 15.36,19.78 21.22,13.93 21.22,13.6 21.7,13.12 22.34,13.12 30.6,4.86
  vias: v2(30.59,4.86) v2(36.55,6.21)
GPIO41: length 53.4
  Top Layer w0.254: v1(11.99,22.92) 13.03,22.92 13.93,23.82 13.93,24.35 13.47,24.8 12.15,24.8 8.88,28.07 U1.34
  信号层1 w0.254: v1(11.99,22.92) 16.01,22.92 16.83,23.73 20.73,23.73 21.54,22.93 29.86,22.93 29.93,22.85 30.67,22.85 35.99,17.53 35.99,13.37
  Bottom Layer w0.254: U16.10 40.41,5.59 35.99,10.01 35.99,13.37
  vias: v2(36,13.35)
GPIO42: length 54.1
  Top Layer w0.254: 7.62,29.07 7.62,28.07 8.11,28.07 12.06,24.12 v1(13.18,24.12)
  信号层1 w0.254: v1(36.23,21.64) 33.57,24.29 30.08,24.29 29.91,24.12 v1(13.18,24.12)
  Bottom Layer w0.254: U16.11 44.34,5.79 36.23,13.9 v1(36.23,21.64)
GPIO45: length 46.6
  Top Layer w0.254: v1(20.23,26.88) 20.03,27.08 20.03,27.3 19.03,27.3
  信号层1 w0.254: v1(46.64,5.02) 45.18,6.48 39.31,6.48 35.22,10.57 v1(27.52,10.57)
  Bottom Layer w0.254: v1(27.52,10.57) 24.34,13.75 24.34,22.6 21.34,25.59 21.34,25.87 20.33,26.88 v1(20.23,26.88) ; v1(46.64,5.02) 46.64,5.17 47.06,5.59 48.26,5.59 U16.12
RTS: length 16.9
  Top Layer w0.254: 26.21,8.18 24.63,8.18 24.34,7.9 24.34,7.01 24.58,6.77 24.59,6.77 24.94,6.41 29.21,6.41 29.25,6.44 29.6,6.44 29.64,6.41 32.65,6.41 32.71,6.35 33.72,6.35 33.78,6.41 33.94,6.41 33.97,6.43 U4.24 ; 26.21,8.18 26.25,8.13 26.25,7.88 26.43,7.7 26.43,7.35 26.95,7.35 ; 26.21,8.18 26.21,9.3 25.32,9.3
SCL: length 15.3
  Top Layer w0.254: 23.44,31.19 24.05,31.19 v1(24.16,31.3) ; 22.17,27.75 23.47,29.05 24.04,29.05 ; 19.06,24.76 20.06,24.76 20.1,24.8 v1(20.25,24.8) 20.25,24.57 20.86,23.96 20.86,23.9 21.02,23.73 21.09,23.73 21.43,23.39 R3.1
  信号层2 w0.254: v1(24.16,31.3) 24.16,28.23 22.73,26.8 22.2,26.8 22.05,26.66 22,26.66 20.25,24.91 v1(20.25,24.8)
  vias: v2(24.09,29.06)
SDA: length 11.6
  Top Layer w0.254: 21.42,24.28 21.42,24.87 v1(20.22,26.07) 20.09,26.07 20.06,26.03 19.06,26.03 ; U14.B4 22.45,27.43 22.32,27.3 ; 23.44,31.69 22.88,31.69 22.88,31.59 v1(22.56,31.27)
  信号层1 w0.254: v1(20.22,26.07) 21.08,26.07 22.32,27.3
  信号层2 w0.254: v1(22.56,31.27) 22.72,31.11 22.72,27.71 22.32,27.3
  vias: v2(22.32,27.3)
U0RXD: length 41.9
  Top Layer w0.254: U1.36 6.34,28.07 8.15,26.26 v1(8.87,26.26) ; v1(27.13,5.66) 34.11,5.66 34.31,5.46 34.62,5.46 35.09,5.94 35.09,6.23 34.97,6.36 U4.26
  Bottom Layer w0.254: v1(8.87,26.26) 8.87,24.26 27.13,6 v1(27.13,5.66)
U0TXD: length 53.1
  Top Layer w0.254: 34.46,6.1 34.47,6.11 U4.25 ; v1(4.38,26.02) 5.08,26.72 5.08,29.07
  信号层1 w0.254: v1(5.64,6.97) 33.59,6.97 34.46,6.1
  Bottom Layer w0.254: v1(4.38,26.02) 4.38,8.23 v1(5.64,6.97)
  vias: v2(34.46,6.12)
USB_D+: length 10.4
  Top Layer w0.254: USB1.3 44.03,11.45 v1(43.93,11.35) 43.42,10.85 D4.2 ; v1(38.05,9.4) 37.99,9.46 U4.4
  信号层1 w0.254: v1(43.93,11.35) 41.97,9.4 v1(38.05,9.4)
USB_D-: length 9.8
  Top Layer w0.254: 43.14,9.39 43.42,9.39 43.42,10.04 44.19,10.8 USB1.2 ; 43.14,9.39 D3.2 ; 43.14,9.39 42.5,10.04 36.92,10.04 U4.5
VOUT1: length 56.2
  Top Layer w0.254: 27.79,30.6 28.79,30.6 28.95,30.45 ; 28.49,29.95 28.95,30.41 28.95,30.45 ; 28.49,29.95 29.02,29.95 29.02,28.12 28.9,28 ; 28.49,29.95 27.79,29.95 ; 28.9,28 30.84,26.06 30.84,24.6 30.53,24.29 30.08,24.29 29.77,23.98 29.77,23.49 28.91,22.64 ; 28.9,28 27.79,28 ; 32.34,16.16 32.36,16.19 U9.12 34.58,16.19 34.7,16.31 34.7,21.15 34.51,21.34 32.32,21.34 ; 32.34,16.16 28.98,16.16 ; 32.34,16.16 32.34,14.91 32.36,14.89 33.47,14.89 ; U9.3 28.95,16.19 28.98,16.16 ; 28.95,30.45 30.09,29.3 32.28,29.3 ; 32.32,21.34 32.16,21.34 32.16,22.64 33.41,22.64 ; 32.32,21.34 30.42,19.44 27.01,19.44 26.89,19.56 26.84,19.56 26.58,19.82 26.58,21.34 29.06,21.34 29.06,22.5 28.91,22.64 ; U7.10 32.1,28 32.1,29.12 32.28,29.3 ; 28.98,16.16 29.18,15.96 29.18,14.89 27.87,14.89 ; 32.28,29.3 U7.12 ; 28.91,22.64 27.81,22.64
$1N2540: length 1.6
  Top Layer w0.254: R1.2 41.58,24.17 41.63,24.12 41.63,23.46
$1N5698: length 1.9
  Top Layer w0.254: R5.2 38.1,24.12 38.3,23.92 38.64,23.92 38.64,23.11
$1N5744: length 1.6
  Top Layer w0.254: R6.1 41.58,20.9 41.63,20.95 LED2.2
$1N5776: length 10.6
  Top Layer w0.254: 43.23,21.61 43.89,21.61 43.89,22.26 v1(43.95,22.33) ; 36.74,23.11 36.74,22.68 37.77,21.64 v1(38.11,21.64)
  信号层1 w0.254: v1(38.11,21.64) 39.7,23.23 43.24,23.23 43.95,22.52 v1(43.95,22.33)
$1N6032: length 1.8
  Top Layer w0.254: 36.74,20.41 36.74,19.61 36.94,19.61 R9.2
$1N7305: length 9.8
  Top Layer w0.254: 38.36,12.54 35.97,12.54 35.97,11.84 ; 38.36,12.54 38.36,11.67 38.39,11.63 C6.2 ; 38.36,12.54 38.36,17.61
$1N7502: length 13.6
  Top Layer w0.254: 34.81,14.78 35.02,14.78 35.54,14.26 35.54,13.88 35.42,13.76 35.42,12.58 35.47,12.54 U4.9 ; v1(30.29,8.4) 29.94,8.75 29.94,8.8 29.77,8.98 29.77,10.09
  信号层2 w0.254: v1(30.29,8.4) 30.29,10.26 34.81,14.78
  vias: v2(34.8,14.78)
$1N7540: length 6.3
  Top Layer w0.254: U4.11 34.47,12.68 30.23,12.68 29.75,12.21 R13.2
$1N7794: length 2
  Top Layer w0.254: 24.22,20.93 24.22,20.1 24.1,19.97 U6.1
$1N8190: length 2.5
  Top Layer w0.254: R17.1 21.91,7.43 21.91,7.81 22.44,8.35 Q3.3
$1N8194: length 4.7
  Top Layer w0.254: Q4.3 22.44,12.3 21.37,11.24 R18.1
$1N8229: length 3.6
  Top Layer w0.254: R15.2 28.02,7.36 27.49,6.82 27.37,6.82 27.34,6.79 25.93,6.79 25.32,7.4
$1N8232: length 4.3
  Top Layer w0.254: 26.95,8.22 26.95,10.24 26.91,10.29 26.91,10.65 26.21,11.35 25.32,11.35
$1N11489: length 8.6
  Top Layer w0.254: 31.29,32.41 30.47,32.41 30.46,32.42 R21.1 29.92,31.72 28.7,31.72 28.5,31.93 27.67,31.93 26.66,30.92 26.66,30.86 26.61,30.82 26.61,29.3 27.79,29.3
$1N12314: length 11.6
  Top Layer w0.254: SW3.3 45.51,23.46 41.2,27.77 40.24,27.77 ; 40.24,27.77 40.18,27.71 38.34,27.71 38.34,28.53 ; 40.24,27.77 U2.1

## Copper pours and planes (outline as drawn; the poured copper is in the pictures)
GND on Top Layer: 0.04,40.64 50.82,40.64 50.82,0.05 0.04,0.05
GND on Bottom Layer: 0.05,40.61 50.75,40.61 50.75,0.06 0.05,0.06
GND on 信号层1: 0.04,40.59 50.9,40.59 50.9,0.02 0.04,0.02
GND on 信号层2: 0.07,40.64 50.8,40.64 50.8,-0.02 0.07,-0.02

Small or netless copper shapes (teardrops, artwork), in the pictures only: 386 on Top Layer, 116 on Bottom Layer, 53 on 信号层1, 26 on 信号层2

## Text on the board
Top Silkscreen Layer: JLab   Ver 2.2.C | Designed by PrestonYu | GPIO18→19→20→21→35→36→37→39→40→41→42→GPIO45 | GPIO17→GIN10→...→GIN0
